# Altium schematic sheet CoG_PWR.SchDoc
size A3; Author: Audran; CompanyName: Goldorak; Address1: Electrolab; Address2: 52 rue Paul Lescop; Address3: 92000 Nanterre; ProjectName: Cartes_2017
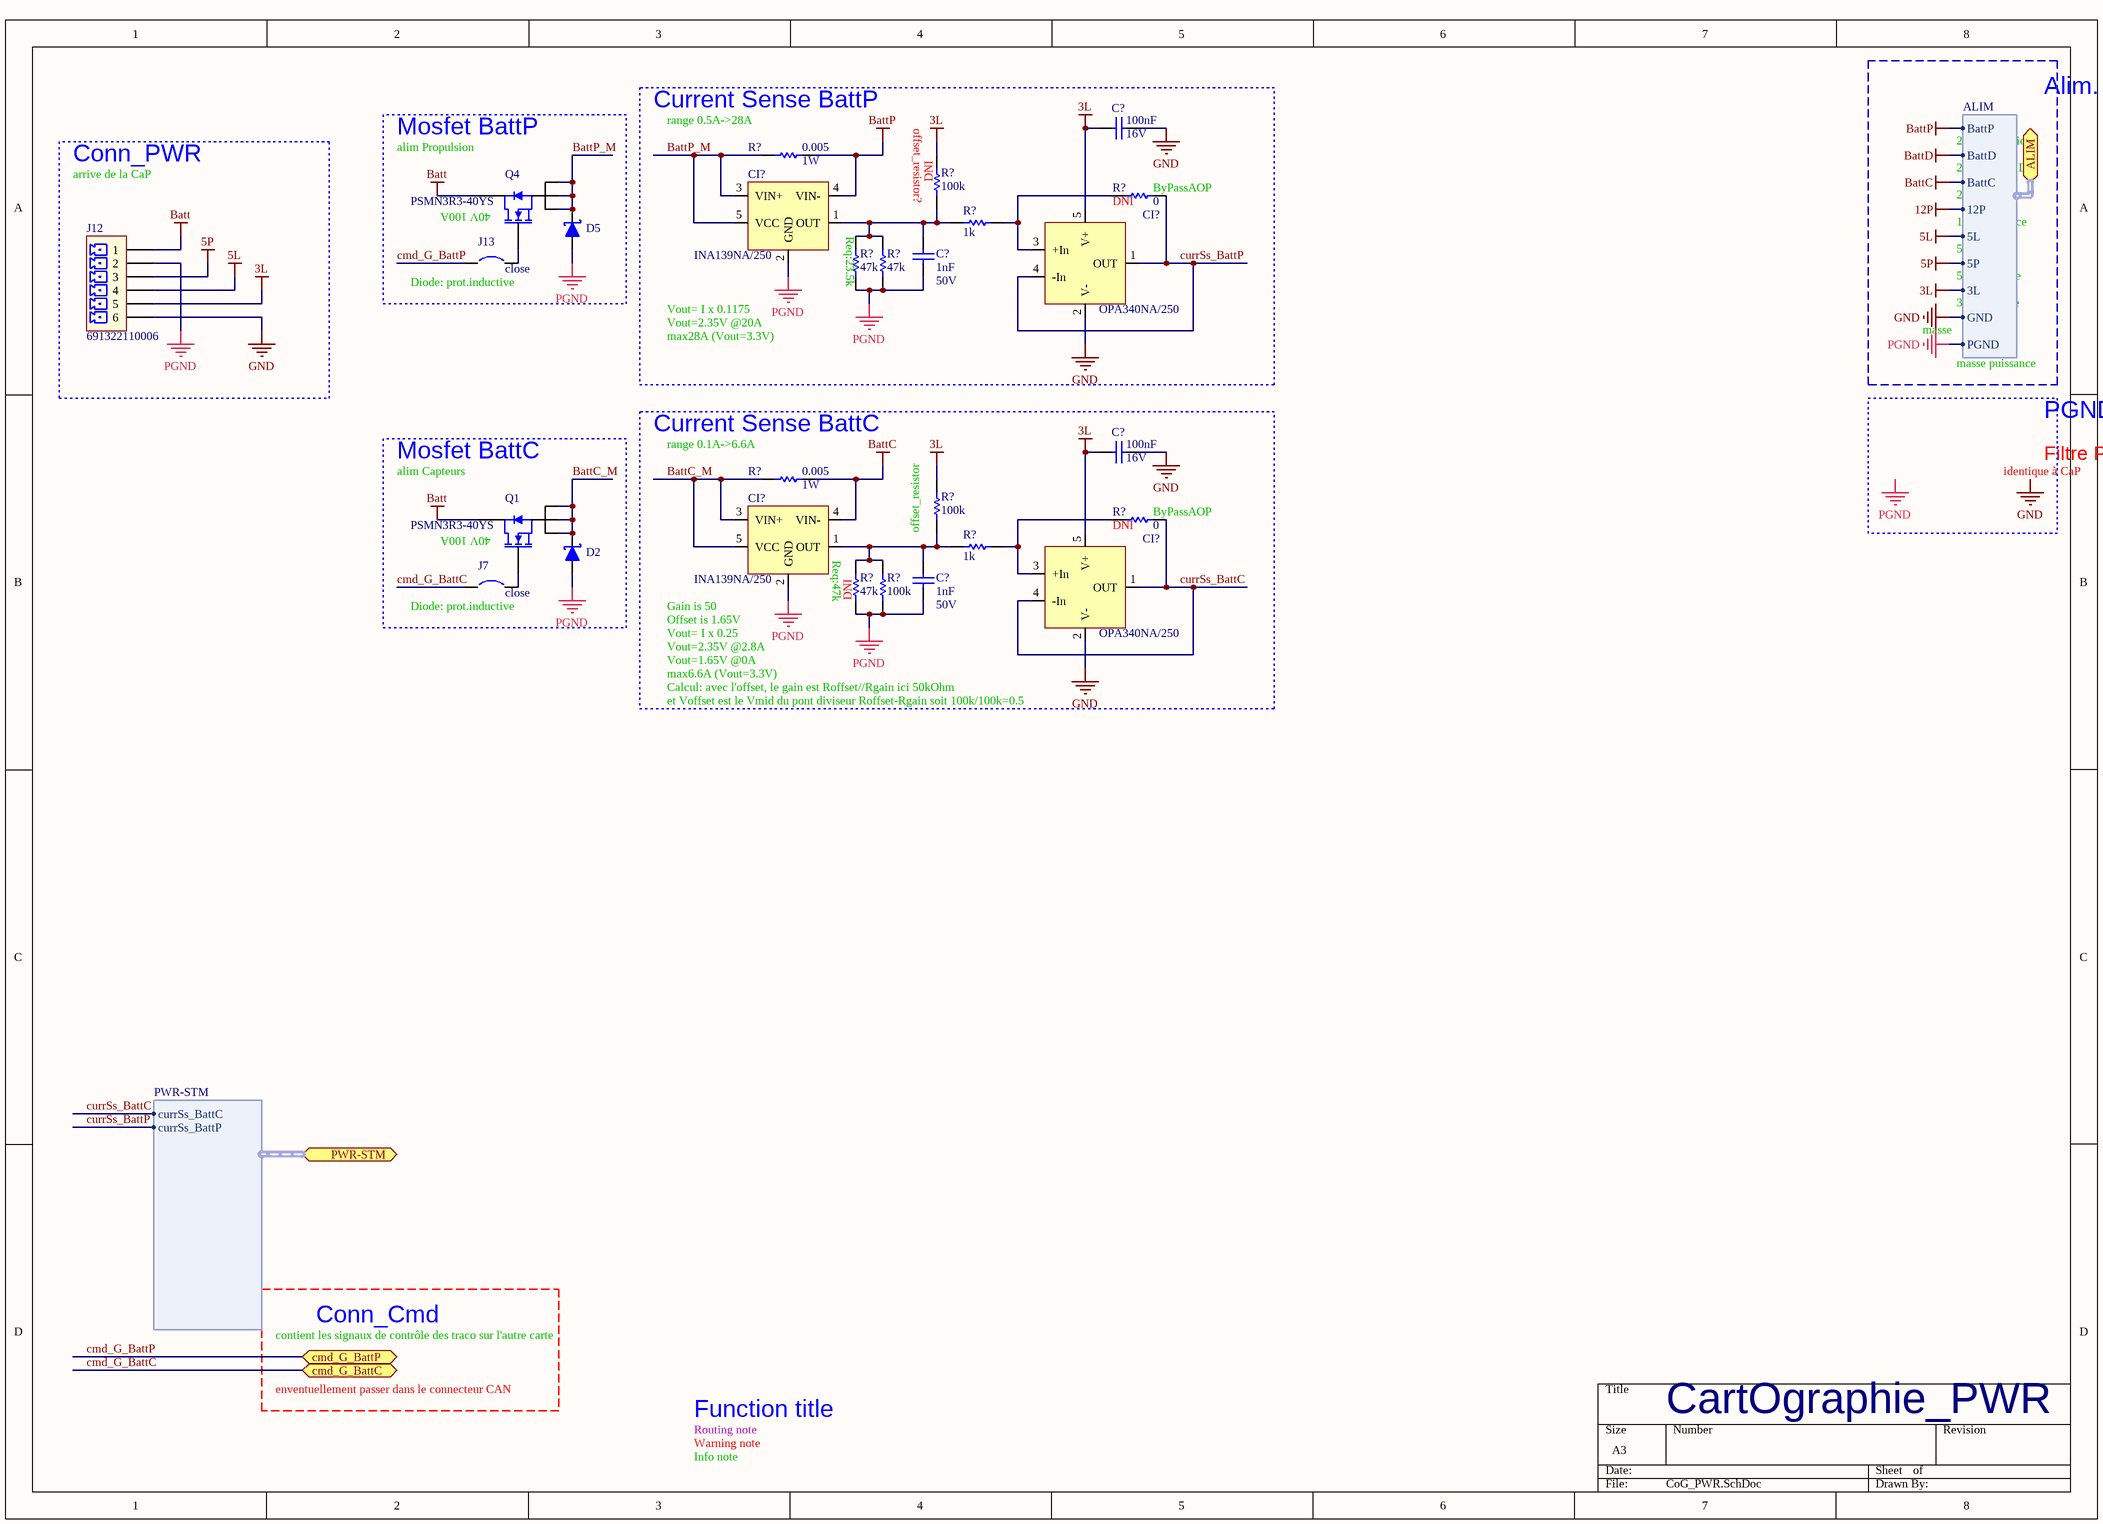
[diagram p0: CoG_PWR.SchDoc]

## Parts
(Parts that share a designator on the sheet are numbered #1, #2 ... from top to bottom, then left to right.)
C?#1  100nF  RatedVoltage: 16V  [WCAP-CSGP_0402, 1x0.5x0.5]
C?#2  1nF  RatedVoltage: 50V  [WCAP-CSGP_0402, 1x0.5x0.5]
C?#3  100nF  RatedVoltage: 16V  [WCAP-CSGP_0402, 1x0.5x0.5]
C?#4  1nF  RatedVoltage: 50V  [WCAP-CSGP_0402, 1x0.5x0.5]
CI?#1  INA139NA/250  [SOT95P245X145-5N]
CI?#2  OPA340NA/250  [SOT95P245X145-5N]
CI?#3  INA139NA/250  [SOT95P245X145-5N]
CI?#4  OPA340NA/250  [SOT95P245X145-5N]
D2  RBR3MM40ATFTR  [SOD-123FL]  (value not drawn)
D5  RBR3MM40ATFTR  [SOD-123FL]  (value not drawn)
J7  close  [SB_0603]  (no BOM)
J12  691322110006  [691322110006]
J13  close  [SB_0603]  (no BOM)
Q1  PSMN3R3-40YS  [LFPAK (SOT669)]
Q4  PSMN3R3-40YS  [LFPAK (SOT669)]
R?#1  value 0.005  Power: 1W  [WSLP1206]  (hidden comment: WSLP12065L000FEA)
R?#2  value 0  [RESC1005X04N]  (hidden comment: RC0402JR-070RL)
R?#3  value 100k  [RESC1005X04N]  (hidden comment: RC0402FR-07100KL)
R?#4  value 1k  [RESC1005X04N]  (hidden comment: RC0402FR-071KL)
R?#5  value 47k  [RESC1005X04N]
R?#6  value 47k  [RESC1005X04N]
R?#7  value 0.005  Power: 1W  [WSLP1206]  (hidden comment: WSLP12065L000FEA)
R?#8  value 0  [RESC1005X04N]  (hidden comment: RC0402JR-070RL)
R?#9  value 100k  [RESC1005X04N]  (hidden comment: RC0402FR-07100KL)
R?#10  value 1k  [RESC1005X04N]  (hidden comment: RC0402FR-071KL)
R?#11  value 47k  [RESC1005X04N]
R?#12  value 100k  [RESC1005X04N]  (hidden comment: RC0402FR-07100KL)

## Blocks framed on the sheet
Conn_PWR: J12
Mosfet BattP: D5 J13 Q4
Current Sense BattP: C?#1 C?#2 CI?#1 CI?#2 R?#1-R?#6
Mosfet BattC: D2 J7 Q1
Current Sense BattC: C?#3 C?#4 CI?#3 CI?#4 R?#7-R?#12

## Ports
ALIM (harness ALIM), cmd_G_BattC, cmd_G_BattP, PWR-STM (harness PWR-STM)

## Harnesses
PWR-STM: currSs_BattC, currSs_BattP
ALIM: BattP, BattD, BattC, 12P, 5L, 5P, 3L, GND, PGND

## Nets
3L: C?#1.1 C?#3.1 CI?#2.5(V+) CI?#4.5(V+) J12.5 R?#3.2 R?#9.2 ; port ALIM.3L
5L: J12.4 ; port ALIM.5L
5P: J12.3 ; port ALIM.5P
12P: port ALIM.12P
Batt: J12.1 Q1.5(D) Q4.5(D)
BattC: CI?#3.4(VIN-) R?#7.2 ; port ALIM.BattC
BattD: port ALIM.BattD
BattP: CI?#1.4(VIN-) R?#1.2 ; port ALIM.BattP
GND: C?#1.2 C?#3.2 CI?#2.2(V-) CI?#4.2(V-) J12.6 ; port ALIM.GND
PGND: C?#2.1 C?#4.1 CI?#1.2(GND) CI?#3.2(GND) D2.1 D5.1 J12.2 R?#5.1 R?#6.1 R?#11.1 R?#12.1 ; port ALIM.PGND
BattC_M: CI?#3.3(VIN+) CI?#3.5(VCC) D2.2 Q1.1(S) Q1.2(S) Q1.3(S) R?#7.1
BattP_M: CI?#1.3(VIN+) CI?#1.5(VCC) D5.2 Q4.1(S) Q4.2(S) Q4.3(S) R?#1.1
cmd_G_BattC: J7.1 ; port cmd_G_BattC
cmd_G_BattP: J13.1 ; port cmd_G_BattP
currSs_BattC: CI?#4.1(OUT) CI?#4.4(-In) R?#8.2 ; port PWR-STM.currSs_BattC
currSs_BattP: CI?#2.1(OUT) CI?#2.4(-In) R?#2.2 ; port PWR-STM.currSs_BattP
NetC?#2_2: C?#2.2 CI?#1.1(OUT) R?#3.1 R?#4.1 R?#5.2 R?#6.2
NetC?#4_2: C?#4.2 CI?#3.1(OUT) R?#9.1 R?#10.1 R?#11.2 R?#12.2
NetCI?#2_3: CI?#2.3(+In) R?#2.1 R?#4.2
NetCI?#4_3: CI?#4.3(+In) R?#8.1 R?#10.2
NetJ7_2: J7.2 Q1.4(G)
NetJ13_2: J13.2 Q4.4(G)

## Notes on the sheet
- (near R?#1) range 0.5A->28A
- offset_resistor?
- Alim.
- arrive de la CaP
- (near Q4) alim Propulsion
- (near R?#3) DNI
- (near R?#2) ByPassAOP
- 22V Propulsion
- 22V Moteur DC
- 22V Capteur
- (near Q4) 40V 100A
- (near R?#5) Req:23.5k
- (near R?#2) DNI
- 5V logique
- 12V puissance
- (near J13) Diode: prot.inductive
- Vout= I x 0.1175
- Vout=2.35V @20A
- masse
- 5V puissance
- 3.3V logique
- max28A (Vout=3.3V)
- masse puissance
- (near R?#7) range 0.1A->6.6A
- Filtre PGND->GND
- PGND->GND
- (near Q1) alim Capteurs
- (near Q1) 40V 100A
- (near R?#9) offset_resistor
- (near R?#8) DNI
- (near R?#8) ByPassAOP
- identique à CaP
- (near CI?#3) Req:47k
- (near R?#11) DNI
- (near J7) Diode: prot.inductive
- Vout= I x 0.25
- Vout=2.35V @2.8A
- (near CI?#3) Gain is 50
- (near CI?#3) Offset is 1.65V
- Vout=1.65V @0A
- max6.6A (Vout=3.3V)
- Calcul: avec l'offset, le gain est Roffset//Rgain ici 50kOhm
- et Voffset est le Vmid du pont diviseur Roffset-Rgain soit 100k/100k=0.5
- contient les signaux de contrôle des traco sur l'autre carte
- Conn_Cmd
- enventuellement passer dans le connecteur CAN
- Routing note
- Warning note
- Info note
- Function title
- CartOgraphie_PWR
- Labels drawn without touching a wire or pin: GND, PGND

## Library data of the parts
C?#1 C?#3 = WCAP-CSGP, 885012205037: CAP CER 100nF 16V X7R 0402; Manufacturer: Wurth Elektronik; PublishedDate: Aug 2016; ComponentLink1Description: Manufacturer; ComponentLink1URL: http://www.we-online.de; ComponentLink2Description: Datasheet; ComponentLink2URL: http://katalog.we-online.com/pbs/datasheet/885012205037.pdf; Value: 100nF; Size: 0402; CeramicType: X7R; Manufacturer Part Number: 885012205037
C?#2 C?#4 = WCAP-CSGP, 885012205061: CAP CER 1nF 50V X7R 0402; Manufacturer: Wurth Elektronik; PublishedDate: Aug 2016; ComponentLink1Description: Manufacturer; ComponentLink1URL: http://www.we-online.de; ComponentLink2Description: Datasheet; ComponentLink2URL: http://katalog.we-online.com/pbs/datasheet/885012205061.pdf; Manufacturer Part Number: 885012205061; Value: 1nF; Size: 0402; CeramicType: X7R
CI?#1 CI?#3 = INA139NA/250: IC CURRENT MONITOR 0.5% SOT23-5; Manufacturer: Texas Instruments; Supplier 1: Farnell; Supplier Part Number 1: 1470398; Manufacturer Part Number: INA139NA/250; ComponentLink1URL: http://www.ti.com/lit/ds/symlink/ina139.pdf; ComponentLink1Description: http://www.ti.com/lit/ds/symlink/ina139.pdf
CI?#2 CI?#4 = OPA340NA/250: IC OP AMP GP 5.5MHZ RRIO SOT23-5; Manufacturer: Texas Instruments; Supplier 1: Farnell; Supplier Part Number 1: 1470372; ComponentLink1URL: http://www.ti.com/lit/ds/symlink/opa2340.pdf; ComponentLink1Description: http://www.ti.com/lit/ds/symlink/opa2340.pdf; Manufacturer Part Number: OPA340NA/250
D2 D5 = RBR3MM40ATFTR: DIODE SCHOTTKY 40V 3A SOD123-FL; Manufacturer: ROHM; Type: Schottky; ReverseVoltage: 40V; ContinuousForwardCurrent: 3A; ComponentLink1Description: Manufacturer; ComponentLink1URL: http://www.rohm.com/web/global/products/-/product/RBR3MM40ATF; ComponentLink2URL: http://www.farnell.com/datasheets/2067190.pdf; ComponentLink2Description: Datasheet; Supplier 1: Farnell; Supplier Part Number 1: 2581593; Manufacturer Part Number: RBR3MM40ATFTR
J7 J13 = CAVALIER_0603: Circuit Breaker (cavalier soudure) empreinte dipole 0603
J12 = 691322110006: TERM BLOCK HDR 6POS 90DEG 3.5MM; Manufacturer: Wurth Electronics Inc.; Supplier 1: Farnell; Manufacturer Part Number: 691322110006; ComponentLink1URL: http://katalog.we-online.de/em/datasheet/6913221100xx.pdf; ComponentLink1Description: Datasheet; Supplier Part Number 1: 1841319
Q1 Q4 = PSMN3R3-40YS: MOSFET N  40V 100A LFPAK; Manufacturer: NEXPERIA; Manufacturer Part Number: PSMN3R3-40YS; ComponentLink1URL: http://www.farnell.com/datasheets/1230735.pdf; ComponentLink1Description: Datasheet; Pricing: 1=0.498, 25=0.488, 100=0.486, 250=0.476, 500=0.467, 3000=0.457, 7000=0.447, 20000=0.437 (EUR); Supplier 1: Farnell; Supplier Part Number 1: 1845655
R?#1 R?#7 = WSLP12065L000FEA: RES 0.005 OHM 1% 1W 1206; Manufacturer: Vishay Dale; Vmax: 200V; Type: Metal Strip; Manufacturer Part Number: WSLP12065L000FEA; Precision: ±1%; Supplier 1: Farnell; ComponentLink1URL: https://www.vishay.com/product?docid=30122; ComponentLink1Description: Manufacturer; ComponentLink2URL: http://www.farnell.com/datasheets/2182713.pdf; ComponentLink2Description: Datasheet; Supplier Part Number 1: 2420761
R?#2 R?#8 = RC0402JR-070RL: RES SMD 0 OHM 5% 1/16W 0402; Manufacturer: Yageo; Power: 63mW; Vmax: 50V; Type: Thick Film; ComponentLink1Description: Manufacturer; ComponentLink1URL: http://www.yageo.com/NewPortal/_en/index.jsp; ComponentLink2Description: Datasheet; ComponentLink2URL: http://www.farnell.com/datasheets/1018594.pdf; Manufacturer Part Number: RC0402JR-070RL; Supplier 1: Farnell; Supplier Part Number 1: 9232516; Precision: ±5%
R?#3 R?#9 R?#12 = RC0402FR-07100KL: RES SMD 100K OHM 1% 1/16W 0402; Manufacturer: Yageo; Power: 63mW; Vmax: 50V; Type: Thick Film; ComponentLink1Description: Manufacturer; ComponentLink1URL: http://www.yageo.com/NewPortal/_en/index.jsp; ComponentLink2Description: Datasheet; ComponentLink2URL: http://www.farnell.com/datasheets/2167052.pdf; Manufacturer Part Number: RC0402FR-07100KL; Supplier 1: Farnell; Supplier Part Number 1: 9239472; Precision: ±1%
R?#4 R?#10 = RC0402FR-071KL: RES SMD 1K OHM 1% 1/16W 0402; Manufacturer: Yageo; Power: 63mW; Vmax: 50V; Type: Thick Film; ComponentLink1Description: Manufacturer; ComponentLink1URL: http://www.yageo.com/NewPortal/_en/index.jsp; ComponentLink2Description: Datasheet; ComponentLink2URL: http://www.farnell.com/datasheets/2167052.pdf; Manufacturer Part Number: RC0402FR-071KL; Supplier 1: Farnell; Supplier Part Number 1: 9239235; Precision: ±1%
R?#5 R?#6 R?#11 = RC0402FR-0747KL: RES SMD 47K OHM 1% 1/16W 0402; Manufacturer: Yageo; Power: 63mW; Vmax: 50V; Type: Thick Film; ComponentLink1Description: Manufacturer; ComponentLink1URL: http://www.yageo.com/NewPortal/_en/index.jsp; ComponentLink2Description: Datasheet; ComponentLink2URL: http://www.farnell.com/datasheets/2167052.pdf; Manufacturer Part Number: RC0402FR-0747KL; Supplier 1: Farnell; Supplier Part Number 1: 9239430; Precision: ±1%